# EAGLE design Bluesaab RN52 v5.5-DPAK (EAGLE 7.3.0)
All components except RN52 chip are back to top of PCB
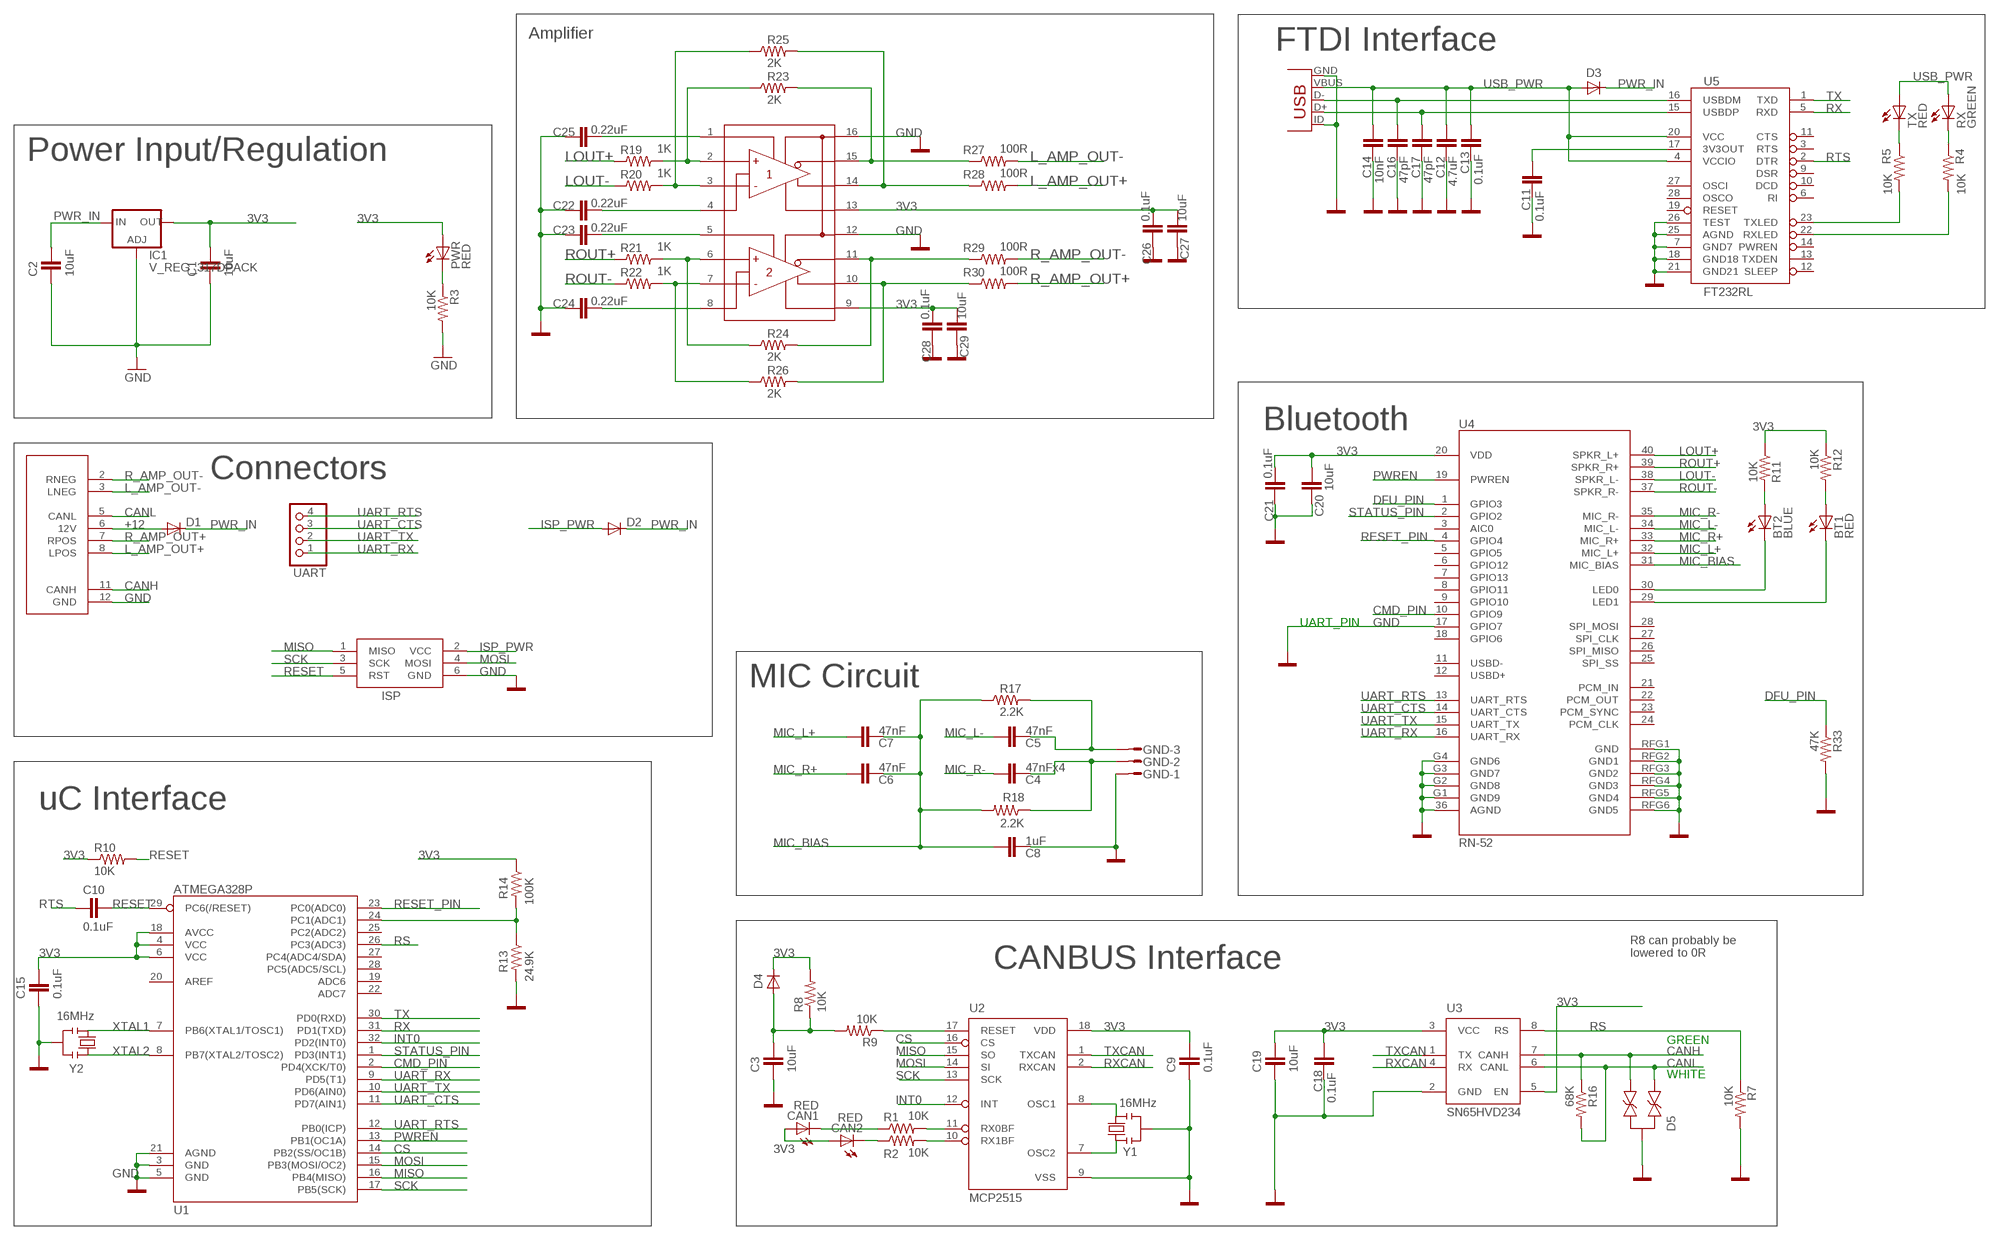
[diagram p0: schematic, sheet 1]

## Parts
BT1  RED  LEDCHIPLED_0805  [CHIPLED_0805]
BT2  BLUE  LEDCHIPLED_0805  [CHIPLED_0805]
C1  10uF  C-EUC0805K  [C0805K]
C2  10uF  C-EUC0805K  [C0805K]
C3  10uF  C-EUC0805K  [C0805K]
C4  47nFx4  C-EUC0805K  [C0805K]
C5  47nF  C-EUC0805K  [C0805K]
C6  47nF  C-EUC0805K  [C0805K]
C7  47nF  C-EUC0805K  [C0805K]
C8  1uF  C-EUC0805K  [C0805K]
C9  0.1uF  C-EUC0805K  [C0805K]
C10  0.1uF  C-EUC0805K  [C0805K]
C11  0.1uF  C-EUC0805K  [C0805K]
C12  4.7uF  C-EUC0805K  [C0805K]
C13  0.1uF  C-EUC0805K  [C0805K]
C14  10nF  C-EUC0805K  [C0805K]
C15  0.1uF  C-EUC0805K  [C0805K]
C16  47pF  C-EUC0805K  [C0805K]
C17  47pF  C-EUC0805K  [C0805K]
C18  0.1uF  C-EUC0805K  [C0805K]
C19  10uF  C-EUC0805K  [C0805K]
C20  10uF  C-EUC0805K  [C0805K]
C21  0.1uF  C-EUC0805K  [C0805K]
C22  0.22uF  C-EUC0805K  [C0805K]
C23  0.22uF  C-EUC0805K  [C0805K]
C24  0.22uF  C-EUC0805K  [C0805K]
C25  0.22uF  C-EUC0805K  [C0805K]
C26  0.1uF  C-EUC0805K  [C0805K]
C27  10uF  C-EUC0805K  [C0805K]
C28  0.1uF  C-EUC0805K  [C0805K]
C29  10uF  C-EUC0805K  [C0805K]
CAN1  RED  LEDCHIPLED_0805  [CHIPLED_0805]
CAN2  RED  LEDCHIPLED_0805  [CHIPLED_0805]
CDC_CONNECTOR  827229-1  [827229-1]
D1  DIODE-SCHOTTKY_  DIODE-SOD123  [SOD123]
D2  DIODE-SCHOTTKY_  DIODE-SOD123  [SOD123]
D3  DIODE-SCHOTTKY_  DIODE-SOD123  [SOD123]
D4  DIODE-SCHOTTKY_  DIODE-SOD123  [SOD123]
D5  DIODE-ARRAY  [SOT23]
GND  S03P  [S03P]
IC1  V_REG_317DPACK  [V-REG_DPACK]
ISP  AVRISP-6  [AVRISP]
PWR  RED  LEDCHIPLED_0805  [CHIPLED_0805]
R1  10K  R-US_R0805  [R0805]
R2  10K  R-US_R0805  [R0805]
R3  10K  R-US_R0805  [R0805]
R4  10K  R-US_R0805  [R0805]
R5  10K  R-US_R0805  [R0805]
R7  10K  R-US_R0805  [R0805]
R8  10K  R-US_R0805  [R0805]
R9  10K  R-US_R0805  [R0805]
R10  10K  R-US_R0805  [R0805]
R11  10K  R-US_R0805  [R0805]
R12  10K  R-US_R0805  [R0805]
R13  24.9K  R-US_R0805  [R0805]
R14  100K  R-US_R0805  [R0805]
R16  68K  R-US_R0805  [R0805]
R17  2.2K  R-US_R0805  [R0805]
R18  2.2K  R-US_R0805  [R0805]
R19  1K  R-US_R0805  [R0805]
R20  1K  R-US_R0805  [R0805]
R21  1K  R-US_R0805  [R0805]
R22  1K  R-US_R0805  [R0805]
R23  2K  R-US_R0805  [R0805]
R24  2K  R-US_R0805  [R0805]
R25  2K  R-US_R0805  [R0805]
R26  2K  R-US_R0805  [R0805]
R27  100R  R-US_R0805  [R0805]
R28  100R  R-US_R0805  [R0805]
R29  100R  R-US_R0805  [R0805]
R30  100R  R-US_R0805  [R0805]
R33  47K  R-US_R0805  [R0805]
RX  GREEN  LEDCHIPLED_0805  [CHIPLED_0805]
TX  RED  LEDCHIPLED_0805  [CHIPLED_0805]
U1  ATMEGA328P  ATMEGA328_SMT  [TQFP32-08]
U2  MCP2515  [SO18L]
U3  SN65HVD234  [SO8]
U4  RN-52  BLUETOOTH-RN-52  [RN-52]
U5  FT232RL  FT232RLSSOP  [SSOP28DB]
U7  THS4522  [TSSOP-16]
UART  PINHD-1X4  [1X04]
UPLOAD  USB-MB-H  [USB-MB-H]
Y1  16MHz  RESONATORSMD  [RESONATOR-SMD]
Y2  16MHz  RESONATORSMD  [RESONATOR-SMD]

## Nets
3V3: C1.2 C9.2 C15.2 C18.1 C19.2 C20.1 C21.2 C26.2 C27.1 C28.2 C29.1 CAN1.A CAN2.A D4.C IC1.4(OUT) PWR.A R8.2 R10.1 R11.1 R12.1 R14.1 U1.4(VCC) U1.6(VCC) U1.18(AVCC) U2.18(VDD) U3.3(VCC) U3.5(EN) U4.20(VDD) U7.9(9.VS+2) U7.13(13.VS+1)
3V3OUT: C11.1 U5.17(3V3OUT)
+12 [12v]: CDC_CONNECTOR.6(12V) D1.A
CANH: CDC_CONNECTOR.11(CANH) D5.2 R16.1 U3.7(CANH)
CANL: CDC_CONNECTOR.5(CANL) D5.1 R16.2 U3.6(CANL)
CMD_PIN: U1.2(PD4(XCK/T0)) U4.10(GPIO9)
CS: U1.14(PB2(SS/OC1B)) U2.16(CS)
DFU_PIN: R33.1 U4.1(GPIO3)
GND: C1.1 C2.1 C3.1 C8.1 C9.1 C11.2 C12.1 C13.2 C14.1 C15.1 C16.1 C17.1 C18.2 C19.1 C20.2 C21.1 C22.2 C23.2 C24.2 C25.2 C26.1 C27.2 C28.1 C29.2 CDC_CONNECTOR.12(GND) D5.3 GND.1 IC1.1(ADJ) ISP.6(GND) R3.2 R7.2 R13.2 R33.2 U1.3(GND) U1.5(GND) U1.21(AGND) U2.9(VSS) U3.2(GND) U4.17(GPIO7) U4.36(AGND) U4.G1(GND9) U4.G2(GND8) U4.G3(GND7) U4.G4(GND6) U4.RFG1(GND) U4.RFG2(GND1) U4.RFG3(GND2) U4.RFG4(GND3) U4.RFG5(GND4) U4.RFG6(GND5) U5.7(GND7) U5.18(GND18) U5.21(GND21) U5.25(AGND) U5.26(TEST) U7.12(12.VS-) U7.16(16.VS-) UPLOAD.GND UPLOAD.ID Y1.2 Y2.2
INT0: U1.32(PD2(INT0)) U2.12(INT)
ISP_PWR: D2.A ISP.2(VCC)
L_AMP_OUT+: CDC_CONNECTOR.8(LPOS) R28.2
L_AMP_OUT-: CDC_CONNECTOR.3(LNEG) R27.2
LOUT+: R19.1 U4.40(SPKR_L+)
LOUT-: R20.1 U4.38(SPKR_L-)
MIC_BIAS: C6.1 C7.1 C8.2 R17.1 R18.2 U4.31(MIC_BIAS)
MIC_L+: C7.2 U4.32(MIC_L+)
MIC_L-: C5.1 U4.34(MIC_L-)
MIC_R+: C6.2 U4.33(MIC_R+)
MIC_R-: C4.1 U4.35(MIC_R-)
MISO: ISP.1(MISO) U1.16(PB4(MISO)) U2.15(SO)
MOSI: ISP.4(MOSI) U1.15(PB3(MOSI/OC2)) U2.14(SI)
N$1: R4.2 U5.22(RXLED)
N$2: R19.2 R23.1 U7.2(2.VIN1+)
N$4: U2.8(OSC1) Y1.3
N$5: U2.7(OSC2) Y1.1
N$6: BT1.A R12.2
N$7: BT2.A R11.2
N$8: R9.1 U2.17(RESET)
N$9: R13.1 R14.2 U1.24(PC1(ADC1))
N$10: R5.2 U5.23(TXLED)
N$11: R20.2 R25.1 U7.3(3.VIN1-)
N$12: R4.1 RX.C
N$13: CAN1.C R1.1
N$14: R21.2 R24.1 U7.6(6.IN2+)
N$15: R5.1 TX.C
N$16: CAN2.C R2.1
N$17: PWR.C R3.1
N$18: R1.2 U2.11(RX0BF)
N$19: R22.2 R26.1 U7.7(7.IN2-)
N$20: C25.1 U7.1(1.PD1)
N$21: C23.1 U7.5(5.PD2)
N$22: C22.1 U7.4(4.OCM1)
N$23: C4.2 GND.2 R18.1
N$24: R23.2 R27.1 U7.15(15.VOUT1-)
N$25: C5.2 GND.3 R17.2
N$26: R25.2 R28.1 U7.14(14.VOUT1+)
N$27: C24.1 U7.8(8.VOCM2)
N$28: BT1.C U4.29(LED1)
N$29: BT2.C U4.30(LED0)
N$31: R2.2 U2.10(RX1BF)
N$32: R24.2 R29.1 U7.11(11.VOUT2-)
N$33: R26.2 R30.1 U7.10(10.VOUT2+)
N$35: C3.2 D4.A R8.1 R9.2
PWR_IN [12v]: C2.2 D1.C D2.C D3.C IC1.3(IN)
PWREN: U1.13(PB1(OC1A)) U4.19(PWREN)
R_AMP_OUT+: CDC_CONNECTOR.7(RPOS) R30.2
R_AMP_OUT-: CDC_CONNECTOR.2(RNEG) R29.2
RESET: C10.2 ISP.5(RST) R10.2 U1.29(PC6(/RESET))
RESET_PIN: U1.23(PC0(ADC0)) U4.4(GPIO4)
ROUT+: R21.1 U4.39(SPKR_R+)
ROUT-: R22.1 U4.37(SPKR_R-)
RS: R7.1 U1.26(PC3(ADC3)) U3.8(RS)
RTS: C10.1 U5.2(DTR)
RX: U1.31(PD1(TXD)) U5.5(RXD)
RXCAN: U2.2(RXCAN) U3.4(RX)
SCK: ISP.3(SCK) U1.17(PB5(SCK)) U2.13(SCK)
STATUS_PIN: U1.1(PD3(INT1)) U4.2(GPIO2)
TX: U1.30(PD0(RXD)) U5.1(TXD)
TXCAN: U2.1(TXCAN) U3.1(TX)
UART_CTS: U1.11(PD7(AIN1)) U4.14(UART_CTS) UART.3
UART_RTS: U1.12(PB0(ICP)) U4.13(UART_RTS) UART.4
UART_RX: U1.9(PD5(T1)) U4.16(UART_RX) UART.1
UART_TX: U1.10(PD6(AIN0)) U4.15(UART_TX) UART.2
USB_PWR: C12.2 C13.1 C14.2 D3.A RX.A TX.A U5.4(VCCIO) U5.20(VCC) UPLOAD.VBUS
USBDM: C16.2 U5.16(USBDM) UPLOAD.D-
USBDP: C17.2 U5.15(USBDP) UPLOAD.D+
XTAL1: U1.7(PB6(XTAL1/TOSC1)) Y2.1
XTAL2: U1.8(PB7(XTAL2/TOSC2)) Y2.3
Unconnected: U1.19(ADC6) U1.20(AREF) U1.22(ADC7) U1.25(PC2(ADC2)) U1.27(PC4(ADC4/SDA)) U1.28(PC5(ADC5/SCL)) U4.3(AIC0) U4.5(GPIO5) U4.6(GPIO12) U4.7(GPIO13) U4.8(GPIO11) U4.9(GPIO10) U4.11(USBD-) U4.12(USBD+) U4.18(GPIO6) U4.21(PCM_IN) U4.22(PCM_OUT) U4.23(PCM_SYNC) U4.24(PCM_CLK) U4.25(SPI_SS) U4.26(SPI_MISO) U4.27(SPI_CLK) U4.28(SPI_MOSI) U5.3(RTS) U5.6(RI) U5.9(DSR) U5.10(DCD) U5.11(CTS) U5.12(SLEEP) U5.13(TXDEN) U5.14(PWREN) U5.19(RESET) U5.27(OSCI) U5.28(OSCO)

## Notes on the sheet
- Amplifier
- FTDI Interface
- Power Input/Regulation
- Bluetooth
- Connectors
- UART_PIN
- MIC Circuit
- uC Interface
- R8 can probably be
  lowered to 0R
- CANBUS Interface
- GREEN
- WHITE

## Library data of the parts
BT1 BT2 CAN1 CAN2 PWR RX TX = led:LED: LED OSRAM: - CHIPLED LG R971, LG N971, LY N971, LG Q971, LY Q971, LO R971, LY R971 LH N974, LH R974 LS Q976, LO Q976, LY Q976 LO Q996 - Hyper CHIPLED LW Q18S LB Q993, LB Q99A, LB R99A - SideLED LS A670, LO A670, LY A670, LG A670, LP A670 LB A673, LV A673, LT A673, LW A673 LH A674 LY A675 LS A676, LA A676, LO A676, LY A676, LW A676 LS A679, LY A679, LG A679 - Hyper Micro SIDELED® LS Y876, LA Y876, LO Y876, LY Y876 LT Y87S - SmartLED LW L88C, LW L88S LB L89C, LB L89S, LG L890 LS L89K, LO L89K, LY L89K LS L896, LA L896, LO L896, LY L896 - TOPLED LS T670, LO T670, LY T670, LG T670, LP T670 LSG T670, LSP T670, LSY T670, LOP T670, LYG T670 LG T671, LOG T671, LSG T671 LB T673, LV T673, LT T673, LW T673 LH T674 LS T676, LA T676, LO T676, LY T676, LB T676, LH T676, LSB T676, LW T676 LB T67C, LV T67C, LT T67C, LS T67K, LO T67K, LY T67K, LW E67C LS E67B, LA E67B, LO E67B, LY E67B, LB E67C, LV E67C, LT E67C LW T67C LS T679, LY T679, LG T679 LS T770, LO T770, LY T770, LG T770, LP T770 LB T773, LV T773, LT T773, LW T773 LH T774 LS E675, LA E675, LY E675, LS T675 LS T776, LA T776, LO T776, LY T776, LB T776 LHGB T686 LT T68C, LB T68C - Hyper Mini TOPLED® LB M676 - Mini TOPLED Santana® LG M470 LS M47K, LO M47K, LY M47K Source: http://www.osram.convergy.de LUXEON: - LUMILED® LXK2-PW12-R00, LXK2-PW12-S00, LXK2-PW14-U00, LXK2-PW14-V00 LXK2-PM12-R00, LXK2-PM12-S00, LXK2-PM14-U00 LXK2-PE12-Q00, LXK2-PE12-R00, LXK2-PE12-S00, LXK2-PE14-T00, LXK2-PE14-U00 LXK2-PB12-K00, LXK2-PB12-L00, LXK2-PB12-M00, LXK2-PB14-N00, LXK2-PB14-P00, LXK2-PB14-Q00 LXK2-PR12-L00, LXK2-PR12-M00, LXK2-PR14-Q00, LXK2-PR14-R00 LXK2-PD12-Q00, LXK2-PD12-R00, LXK2-PD12-S00 LXK2-PH12-R00, LXK2-PH12-S00 LXK2-PL12-P00, LXK2-PL12-Q00, LXK2-PL12-R00 Source: www.luxeon.com KINGBRIGHT: KA-3528ASYC Source: www.kingbright.com
C1-C29 = rcl:C-EU: CAPACITOR, European symbol
CDC_CONNECTOR = 827229-1:827229-1
D1-D4 = diode_seth:DIODE-: DIODE
D5 = SparkFun-seth:DIODE-ARRAY: NUP2105L, TVS Diode Array
GND = con-amp-mt:S03P: AMP MT CONNECTOR; OC_FARNELL: unknown; OC_NEWARK: unknown
IC1 = SparkFun-PowerIC:V_REG_317: Voltage Regulator Standard LM317 adjustable voltage regulator. AOI (Adjust Output Input). Google 'LM317 Calculator' for easy to use app to get the two resistor values needed. 240/720 for 5V output. 240/390 for 3.3V output. Spark Fun Electronics SKU : COM-00527; PROD_ID: IC-09888
ISP = adafruit:AVRISP: AVR ISP HEADER Standard 6 pin header for AVR programming
R1-R5 R7-R14 R16-R30 R33 = rcl:R-US_: RESISTOR, American symbol
U1 = SparkFun-DigitalIC:ATMEGA328_SMT: 32-Pin Atmega328 part Commonly used on Arduino compatible boards Available in QFP and QFN packages TQFP is IC-09069 QFN is non-stock; PROD_ID: IC-09069
U2 = mcp2515-seth:MCP2515
U3 = ti-can-seth:SN65HVD234
U4 = SparkFun-RF:BLUETOOTH-RN-52
U5 = SparkFun-DigitalIC:FT232RL: USB UART FT232RL 4th Generation USB UART (USB <-> Serial) Controller. Spark Fun Electronics SKU : COM-00650 Production SKU IC-00870; PROD_ID: IC-00870
U7 = ti-differential-amps:THS4522
UART = pinhead:PINHD-1X4: PIN HEADER
UPLOAD = USB Mini_B VERT:USB: USB Connectors USB-MB-H has not been used/tested
Y1 Y2 = SparkFun-seth:RESONATOR: Resonator Small SMD resonator. This is the itty bitty 10/20MHz resonators with built in caps. CSTCE10M0G55 and CSTCE20M0V53. Footprint has been reviewed closely but hasn't been tested yet.

## Net classes
0 default: width 0.254 mm, clearance 0.205 mm
1 12v: width 0.5 mm, clearance 0.205 mm to class 0, clearance 0.205 mm

## Board
Moved U4 (RN52) to south-east to make space to integrated THS4522 amp circuit Moved UART connector, moved audio jack socket Removed Killswitch, 555 circuit, RN52_Firmware update, external amp pins
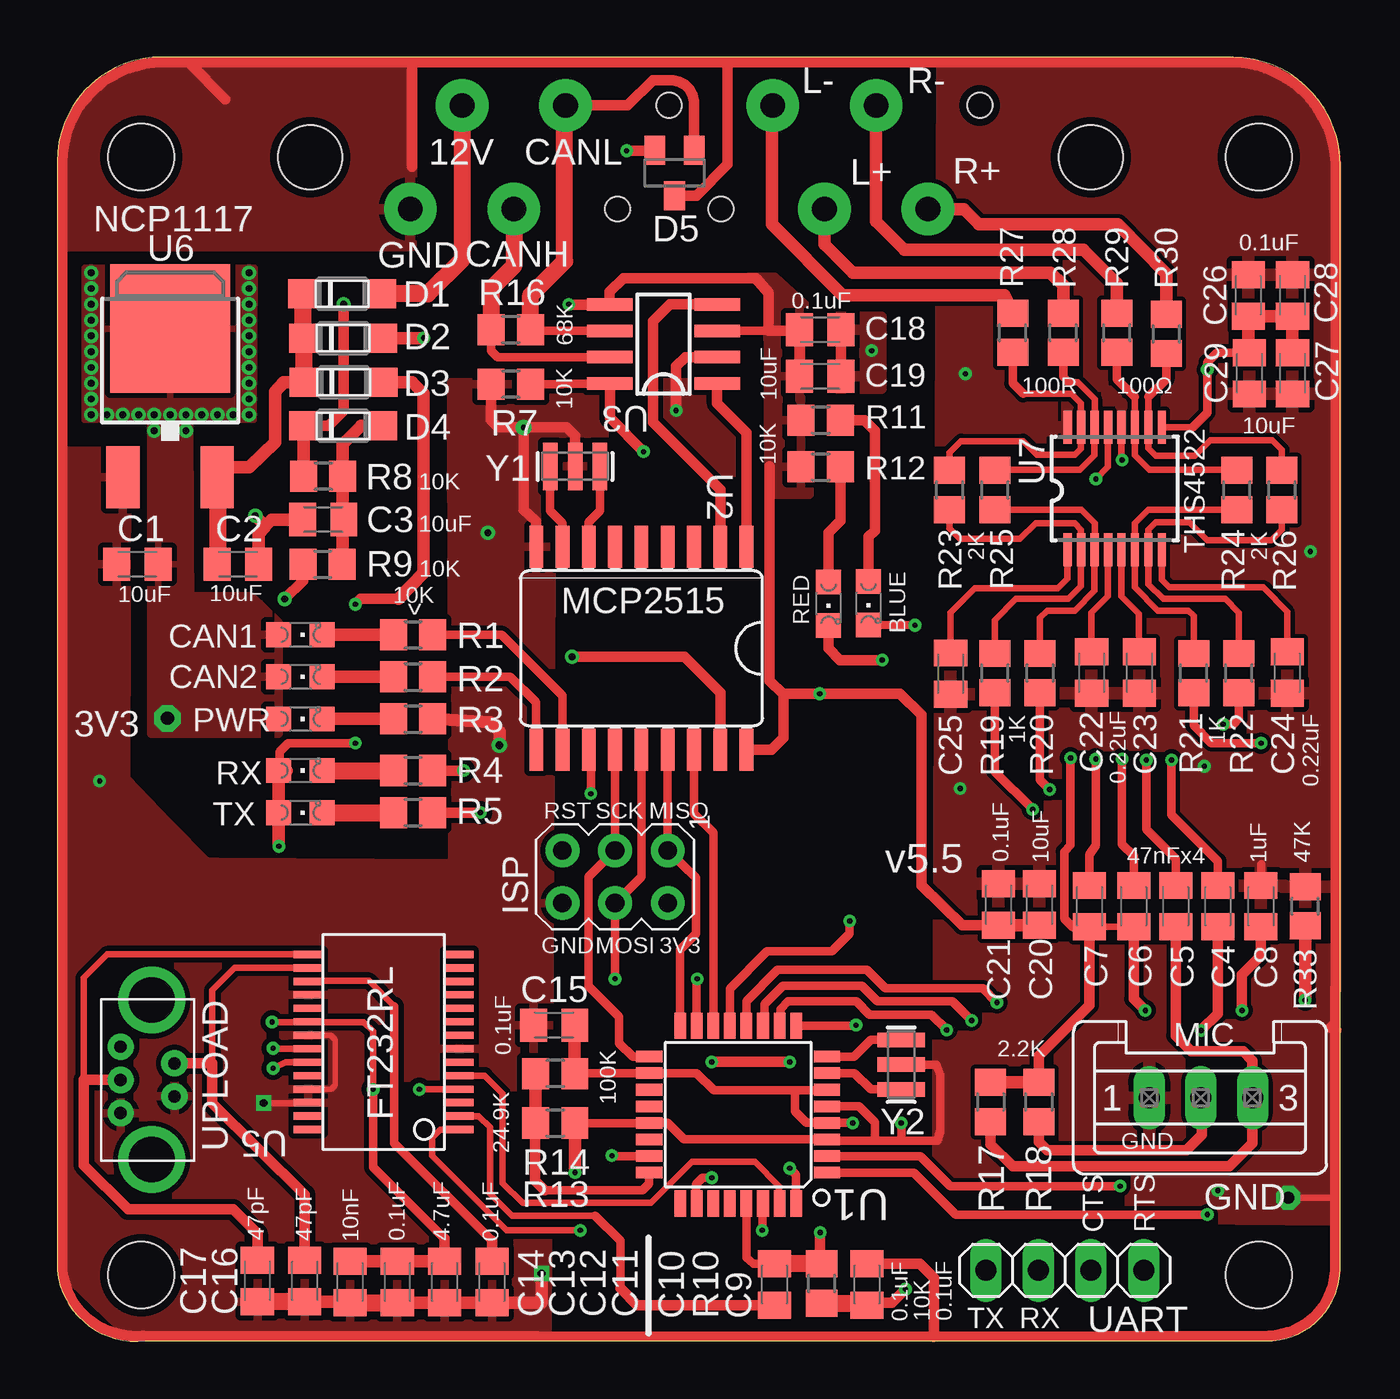
[diagram p1: board, top side]
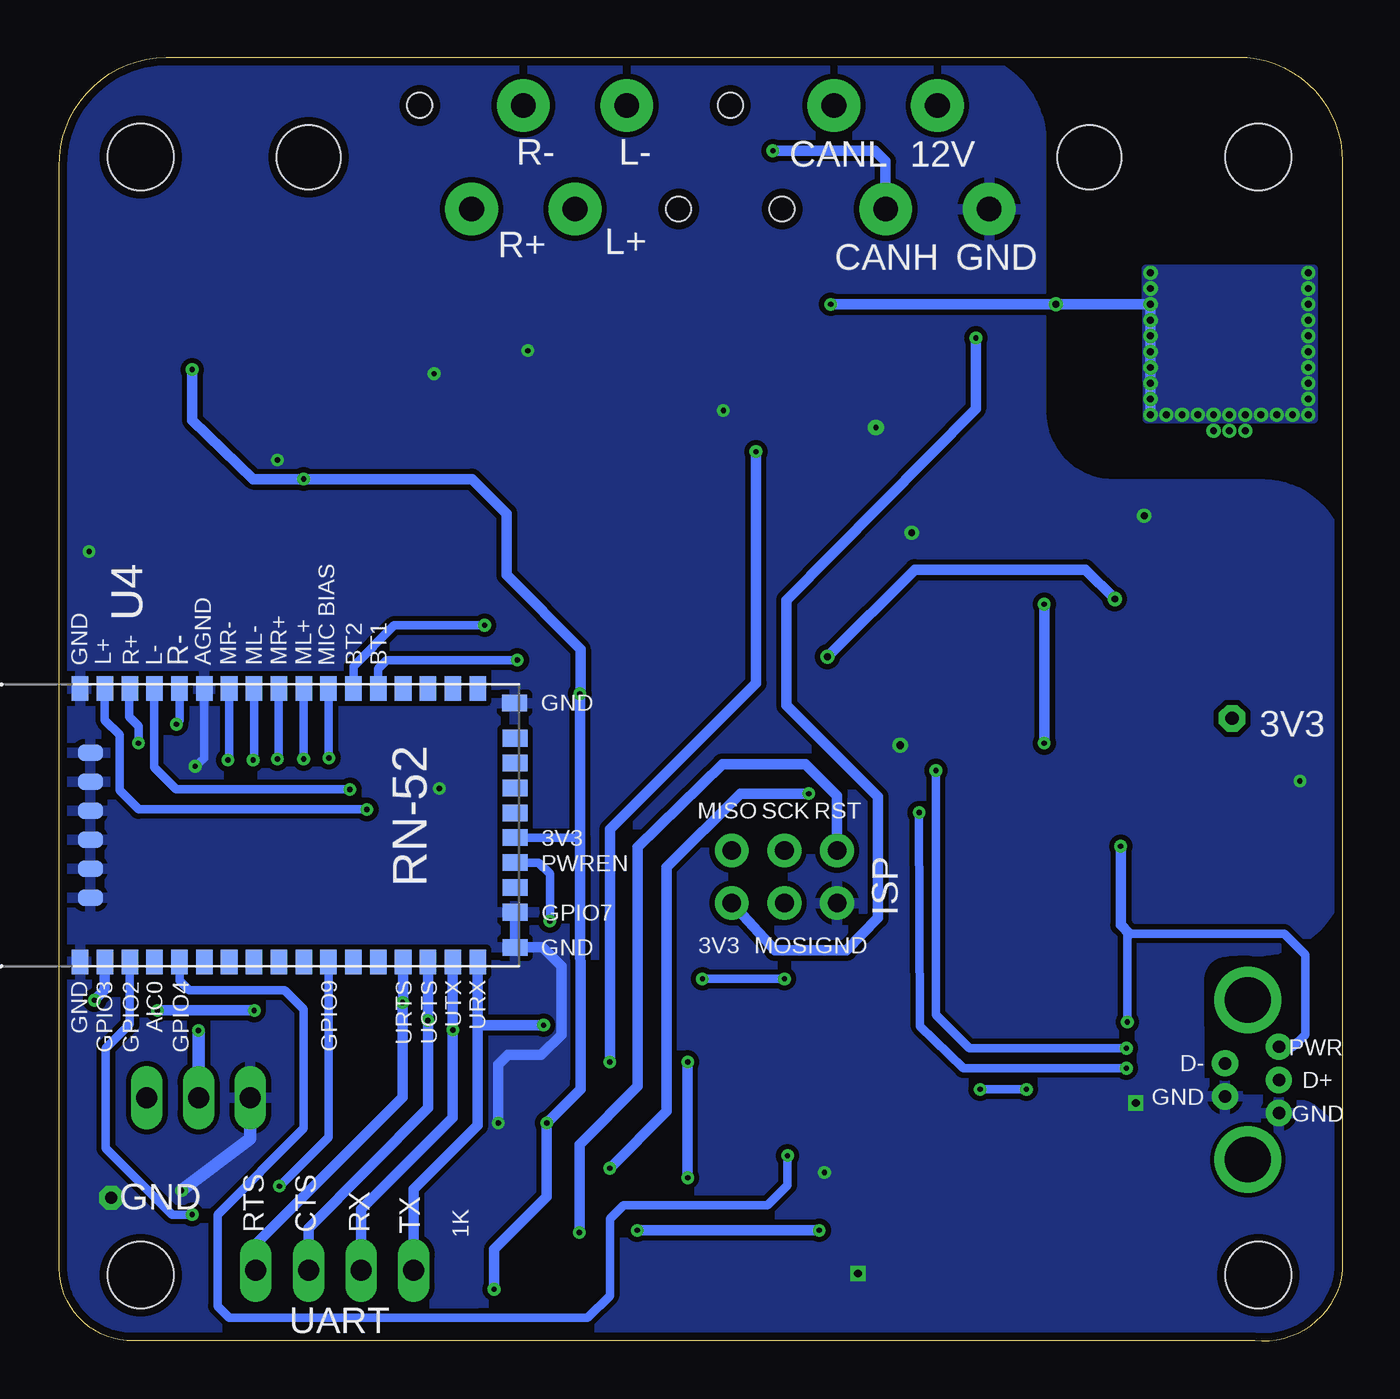
[diagram p2: board, bottom side, seen from below]

Size 61.98 x 62 mm. Coordinates in mm from the lower left corner, seen from the top.
Outline: 56.81,62 5.06,62 arc90 0,56.97 0,3.42 arc90 4.24,0.02 58.4,0.02 arc90 61.98,3.53 61.98,56.71 arc90 56.81,62
Copper layers (1*16): Top 0.0356mm / dielectric 1.5011mm / Bottom 0.0356mm
Design rules "Bluesaab RN52 v5.5-DPAK": minimum track width 8mil, minimum drill 13mil, track to track 0.205mm, track to pad 0.205mm, pad to pad 0.205mm, via to via 0.205mm, smd to smd 6mil, copper to edge 15mil, drill to drill 6mil, minimum pad ring 7mil, minimum via ring 7mil, stop-mask expansion 4mil, vias tented up to drill 15mil, thermal gap 10mil
Holes 3.2 mm at 4.06,57.17 58.04,57.17 58.04,3.2 4.06,3.2

### Footprints (pad centres in the part's own frame; a part is rotated, then mirrored left to right if it is on the bottom)
CHIPLED_0805 = smd 1.2 x 1.2: A 0,-1.05; C 0,1.05
C0805K = smd 1.3 x 1.6: 1 -1,0; 2 1,0
827229-1 = drill 1.2 pad 2.54: 2 2.96,-9.495; 3 2.96,-4.495; 5 2.96,5.505; 6 2.96,10.505; 7 -2.04,-11.995; 8 -2.04,-6.995; 11 -2.04,8.005; 12 -2.04,13.005 | hole 3.1: 0.46,17.84; 0.46,-19.86 | hole 1.2: -2.04,3.005; 2.96,-14.495; -2.04,-1.995; 2.96,0.505
SOD123 = smd 1.4 x 1.4: A 1.9,0; C -1.9,0
SOT23 = smd 1 x 1.4: 1 -0.95,-1.1; 2 0.95,-1.1; 3 0,1.1
S03P = drill 1.016 long: 1 2.5,0; 2 0,0; 3 -2.5,0
V-REG_DPACK = smd 1.6 x 3: 1 -2.28,-4.8; 3 2.28,-4.8 | smd 5.8 x 6.2: 4 0,2.38
AVRISP = drill 0.9 pad 1.626: 1 -1.27,2.54; 2 1.27,2.54; 3 -1.27,0; 4 1.27,0; 5 -1.27,-2.54; 6 1.27,-2.54
R0805 = smd 1.3 x 1.5: 1 -0.95,0; 2 0.95,0
TQFP32-08 = smd 1.27 x 0.559: 1 -4.293,2.8; 2 -4.293,2; 3 -4.293,1.2; 4 -4.293,0.4; 5 -4.293,-0.4; 6 -4.293,-1.2; 7 -4.293,-2; 8 -4.293,-2.8; 17 4.293,-2.8; 18 4.293,-2; 19 4.293,-1.2; 20 4.293,-0.4; 21 4.293,0.4; 22 4.293,1.2; 23 4.293,2; 24 4.293,2.8 | smd 0.559 x 1.27: 9 -2.8,-4.293; 10 -2,-4.293; 11 -1.2,-4.293; 12 -0.4,-4.293; 13 0.4,-4.293; 14 1.2,-4.293; 15 2,-4.293; 16 2.8,-4.293; 25 2.8,4.293; 26 2,4.293; 27 1.2,4.293; 28 0.4,4.293; 29 -0.4,4.293; 30 -1.2,4.293; 31 -2,4.293; 32 -2.8,4.293
SO18L = smd 0.66 x 2.032: 1 -5.08,-4.902; 2 -3.81,-4.902; 3 -2.54,-4.902; 4 -1.27,-4.902; 5 0,-4.902; 6 1.27,-4.902; 7 2.54,-4.902; 8 3.81,-4.902; 9 5.08,-4.902; 10 5.08,4.902; 11 3.81,4.902; 12 2.54,4.902; 13 1.27,4.902; 14 0,4.902; 15 -1.27,4.902; 16 -2.54,4.902; 17 -3.81,4.902; 18 -5.08,4.902
SO8 = smd 0.6 x 2.2: 1 -1.905,-2.6; 2 -0.635,-2.6; 3 0.635,-2.6; 4 1.905,-2.6; 5 1.905,2.6; 6 0.635,2.6; 7 -0.635,2.6; 8 -1.905,2.6
RN-52 = smd 1.2 x 0.8: 1 -6.6,8.33; 2 -6.6,7.13; 3 -6.6,5.93; 4 -6.6,4.73; 5 -6.6,3.53; 6 -6.6,2.33; 7 -6.6,1.13; 8 -6.6,-0.07; 9 -6.6,-1.27; 10 -6.6,-2.47; 11 -6.6,-3.67; 12 -6.6,-4.87; 13 -6.6,-6.07; 14 -6.6,-7.27; 15 -6.6,-8.47; 16 -6.6,-9.67; 25 6.6,-9.67; 26 6.6,-8.47; 27 6.6,-7.27; 28 6.6,-6.07; 29 6.6,-4.87; 30 6.6,-3.67; 31 6.6,-2.47; 32 6.6,-1.27; 33 6.6,-0.07; 34 6.6,1.13; 35 6.6,2.33; 36 6.6,3.53; 37 6.6,4.73; 38 6.6,5.93; 39 6.6,7.13; 40 6.6,8.33; G1 -6.6,9.53; G4 6.6,9.53 | smd 0.8 x 1.2: 17 -4.2,-11.47; 18 -3,-11.47; 19 -1.8,-11.47; 20 -0.6,-11.47; 21 0.6,-11.47; 22 1.8,-11.47; 23 3,-11.47; 24 4.2,-11.47; G2 -5.9,-11.47; G3 5.9,-11.46; RFG1 -3.5,9.03; RFG2 -2.1,9.03; RFG3 -0.7,9.03; RFG4 0.7,9.03; RFG5 2.1,9.03; RFG6 3.5,9.03
SSOP28DB = smd 0.348 x 1.397: 1 -4.225,-3.656; 2 -3.575,-3.656; 3 -2.925,-3.656; 4 -2.275,-3.656; 5 -1.625,-3.656; 6 -0.975,-3.656; 7 -0.325,-3.656; 8 0.325,-3.656; 9 0.975,-3.656; 10 1.625,-3.656; 11 2.275,-3.656; 12 2.925,-3.656; 13 3.575,-3.656; 14 4.225,-3.656; 15 4.225,3.656; 16 3.575,3.656; 17 2.925,3.656; 18 2.275,3.656; 19 1.625,3.656; 20 0.975,3.656; 21 0.325,3.656; 22 -0.325,3.656; 23 -0.975,3.656; 24 -1.625,3.656; 25 -2.275,3.656; 26 -2.925,3.656; 27 -3.575,3.656; 28 -4.225,3.656
TSSOP-16 = smd 0.4 x 1.6: 1 -2.225,-2.85; 2 -1.575,-2.85; 3 -0.925,-2.85; 4 -0.275,-2.85; 5 0.375,-2.85; 6 1.025,-2.85; 7 1.675,-2.85; 8 2.325,-2.85; 9 2.325,3.05; 10 1.675,3.05; 11 1.025,3.05; 12 0.375,3.05; 13 -0.275,3.05; 14 -0.925,3.05; 15 -1.575,3.05; 16 -2.225,3.05
1X04 = drill 1.016 long: 1 -3.81,0; 2 -1.27,0; 3 1.27,0; 4 3.81,0
USB-MB-H = drill 0.6 pad 1.27: D+ 0,0; D- -2.6,0.8; GND 0,-1.6; ID -2.6,-0.8; VBUS 0,1.6 | drill 2.2: P$6 -1.5,-3.85; P$7 -1.5,3.85
RESONATOR-SMD = smd 0.7 x 2.286: 1 -1.2,0; 2 0,0; 3 1.2,0

### Placement (x,y rotation side)
BT1  37.26,35.61 180 top
BT2  39.19,35.63 180 top
C1  3.89,37.51 0 top
C2  8.74,37.51 180 top
C3  12.85,39.67 0 top
C4  56.06,21 270 top
C5  54.03,21 270 top
C6  51.99,21 90 top
C7  49.86,21 90 top
C8  58.14,21 270 top
C9  39.12,2.74 270 top
C10  34.65,2.74 90 top
C11  21.01,2.87 270 top
C12  18.72,2.87 90 top
C13  16.43,2.87 270 top
C14  14.15,2.87 90 top
C15  24,15.26 0 top
C16  11.96,2.92 90 top
C17  9.68,2.92 90 top
C18  36.86,48.84 0 top
C19  36.86,46.58 180 top
C20  47.45,21.08 90 top
C21  45.47,21.08 270 top
C22  49.96,32.28 270 top
C23  52.27,32.28 270 top
C24  59.41,32.28 270 top
C25  43.15,32.23 270 top
C26  57.53,50.49 270 top
C27  59.66,46.73 270 top
C28  59.66,50.49 270 top
C29  57.58,46.73 270 top
CAN1  11.76,34.11 270 top
CAN2  11.76,32.08 270 top
CDC_CONNECTOR  30.07,56.7 90 top
D1  13.77,50.57 0 top
D2  13.82,48.43 0 top
D3  13.84,46.3 0 top
D4  13.82,44.19 0 top
D5  29.82,56.41 180 top
DRILEGEND  [DRILEGEND]  -0.58,-4.24 0 top  (outside the outline)
GND  55.24,11.76 180 top
IC1  5.46,46.5 0 top
ISP  26.95,22.43 270 top
PWR  11.76,30.05 270 top
R1  17.2,34.11 0 top
R2  17.2,32.08 0 top
R3  17.2,30.05 0 top
R4  17.2,27.56 0 top
R5  17.2,25.52 0 top
R7  21.92,46.2 180 top
R8  12.85,41.76 180 top
R9  12.83,37.51 0 top
R10  36.93,2.79 90 top
R11  36.88,44.47 0 top
R12  36.88,42.21 0 top
R13  24.05,10.54 0 top
R14  24.05,12.93 180 top
R16  21.92,48.84 0 top
R17  45.09,11.55 270 top
R18  47.42,11.55 90 top
R19  45.29,32.25 90 top
R20  47.47,32.25 90 top
R21  54.89,32.25 90 top
R22  57.07,32.25 90 top
R23  43.1,41.09 90 top
R24  56.97,41.09 90 top
R25  45.29,41.09 90 top
R26  59.16,41.09 90 top
R27  46.15,48.69 90 top
R28  48.59,48.69 90 top
R29  51.18,48.69 90 top
R30  53.57,48.64 90 top
R33  60.27,21 90 top
RX  11.76,27.56 270 top
TX  11.76,25.52 270 top
U1  32.89,10.94 180 top
U2  28.22,33.45 180 top
U3  29.29,48.14 90 top
U4  51.43,24.91 90 bottom
U5  15.77,14.45 90 top
U7  51.03,41.07 0 top
UART  48.67,3.43 0 top
UPLOAD  3.07,12.62 0 bottom
Y1  25.02,42.24 180 top
Y2  40.77,13.36 90 top

### Tracks (layer width: path | path; a pad name or v marks a point on that pad's centre or on a via)
3V3  (via drill 0.25, 0.33, 0.64 pad 1.27)
  Top 0.305: 37.15,12.11 U1.6 | 35.64,12.01 35.53,12.11 | v38.42,10.54 v38.43,10.54 | 39.07,1.85 C9.2 | U7.13 50.75,42.22 v50.16,41.63 | U7.9 54.84,44.12
  Top 0.406: U3.3 35.83,48.78 | 37.15,12.11 35.53,12.11 31.73,12.11 30.89,12.94 U1.18 25.02,12.94 R14.1 | 35.64,12.01 35.64,11.1 36.19,10.54 U1.4 v38.42,10.54 | C29.1 56.02,47.73 55.55,47.27 v55.55,46.91 55.55,44.83 54.84,44.12
  Top 0.5: U2.18 | U1.18
  Top 0.508: v24.71,50.06 24.73,50.05 U3.5 26.69,50.67 27.36,51.33 33.76,51.33 34.37,50.62 34.37,48.79 35.83,48.78 | 35.89,47.5 C18.1 C19.2 | D4.C 13.11,44.19 13.84,44.93 v13.84,50.06 | C21.2 43.72,20.08 41.73,22.02 41.73,30.25 40.72,31.26 v36.83,31.26 35.05,31.26 | 39.07,1.85 40.31,1.85 v40.97,2.51 | 35.05,31.26 34.42,31.9 34.41,39.4 34.41,42.23 34.42,42.24 | U2.18 34.49,28.55 35.08,29.13 35.08,31.24 35.05,31.26
  Top 0.61: D4.C 11.92,41.78 R8.2 | 39.06,1.84 C9.2 | C20.1 C21.2 | C27.1 C28.2 C26.2 57.53,47.78 C29.1 | C15.2 R14.1
  Top 0.813: R10.1 39.06,1.84 | 35.93,41.89 R12.1
  Bottom 0.305: 36.8,31.29 v36.83,31.26
  Bottom 0.406: U4.20 36.81,24.31
  Bottom 0.508: v24.71,50.06 v13.84,50.06 v9.27,50.06 v9.27,44.73 | v36.83,31.26 36.81,24.31 36.8,12.52 36.79,12.17 v38.43,10.54 38.43,6.98 40.97,4.44 v40.97,2.51 | 36.8,31.29 36.8,33.4 40.36,37 40.36,39.95 42.04,41.63 v50.16,41.63 52.6,41.63 55.55,44.47 v55.55,46.91
  other vias: 1.65,51.58 1.65,50.82 1.65,50.06 1.65,49.3 1.65,47.77 1.65,47.01 1.65,46.25 1.65,45.49 6.22,44.73 6.99,44.73 7.75,44.73 9.27,46.25 9.27,45.49 8.51,44.73 9.27,49.3 9.27,48.54 9.27,47.77 9.27,47.01 4.7,44.73 5.46,44.73 4.7,43.96 5.46,43.96 3.17,44.73 3.94,44.73 2.41,44.73 1.65,44.73 6.22,43.96 5.33,30.07 9.27,50.82 9.27,51.58 1.65,48.54
  pour Bottom: 1.4,51.79 1.4,44.52 9.45,44.52 9.5,51.79
  pour Top: 1.35,51.84 9.55,51.84 9.5,44.47 6.43,44.52 6.48,34.62 4.5,34.67 4.5,44.57 1.35,44.47
  pour Top: 4.55,29.33 10.69,29.33 10.69,34.69 9.37,35.96 4.55,35.96
  pour Top: 34.37,40.87 36.35,40.87 36.3,49.91 34.67,51.38 33.4,51.38 33.81,51.33 34.32,50.77
3V3OUT
  Top 0.305: 16.28,16.18 15.06,17.4 12.14,17.4 U5.17
  Top 0.406: 16.28,16.18 16.28,9.57 21.01,4.85
  Top 0.508: 21.01,4.85 C11.1
+12
  Top 0.813: CDC_CONNECTOR.6 19.56,52.22 17.91,50.57 D1.A
CANH  (via drill 0.25)
  Top 0.406: U3.7 21.27,47.51 20.96,47.83 20.96,48.83 R16.1
  Top 0.508: v27.51,57.48 28.84,57.48 D5.2
  Top 0.813: CDC_CONNECTOR.11 22.06,51.93 20.96,50.82 20.96,48.86 R16.1
  Bottom 0.508: CDC_CONNECTOR.11 22.06,56.96 22.58,57.48 v27.51,57.48
CANL
  Top 0.406: U3.6 22.93,48.78 R16.2 | 30.76,57.52 D5.1 | 30.76,59.76 30.76,59.66
  Top 0.508: 30.76,59.66 30.76,57.52 | 30.76,59.76 arc90 29.64,60.88 29.19,60.88 28.78,60.88 27.56,59.66 CDC_CONNECTOR.5
  Top 0.813: R16.2 22.87,50.5 24.51,52.14 24.51,59.61 CDC_CONNECTOR.5
CMD_PIN  (via drill 0.25)
  Top 0.406: U1.2 41.7,8.94 43.15,7.49 v51.33,7.49
  Bottom 0.406: U4.10 48.96,9.86 v51.33,7.49
CS
  Top 0.406: U2.16 30.76,25.47 31.69,24.54 U1.14
DFU_PIN  (via drill 0.25)
  Top 0.61: v60.27,16.47 R33.1
  Bottom 0.508: U4.1 59.77,16.98 v60.27,16.47
GND  (via drill 0.25, 0.25 pad 0.76, 0.33, 0.38, 0.6 pad 1.14)
  Top 0.254: U5.21 13.21,14.77 13.44,14.55 13.44,12.37 13.23,12.16 12.13,12.16 U5.25
  Top 0.305: v59.46,6.93 61.72,6.93 | U7.12 51.4,42.57 v51.43,42.54 | v9.98,11.5 12.1,11.5 U5.26
  Top 0.406: U1.21 29.48,10.54 30.28,9.74 U1.3 37.26,9.67 39.37,9.67 | 58.15,23.03 C8.1 | Y2.2 42.47,13.36 42.67,12.85 42.67,10.18 42.52,9.67 40.77,9.67 | 40.77,9.67 39.37,9.67 | U1.5 38.72,11.34 39.5,10.56 39.5,9.8 39.37,9.67 | v40.77,10.54 40.77,9.67 | 28.58,10.54 25.17,10.54
  Top 0.5: 0.25,10.15 0.25,9.93
  Top 0.508: 42.34,0.23 4.17,0.28 arc-90 0.25,3.43 0.25,9.93 0.25,56.92 arc-90 5.11,61.74 6.35,61.74 | 42.34,0.23 58.55,0.28 arc90 61.72,3.68 61.72,6.93 61.72,15.01 61.72,17.07 | 6.35,61.74 17.14,61.74 | 17.14,61.74 17.14,56.69 | 17.14,61.74 32.38,61.74 | 32.38,61.74 56.52,61.74 arc-90 61.75,56.87 61.75,16.94 | v22.53,44.12 22.53,40.15 23.14,39.6 U2.9 | 6.35,61.74 8.13,59.97 | Y1.2 25.02,43.71 24.61,44.12 v22.53,44.12 | U3.2 30.34,47.51 29.9,47.06 v29.9,44.93 | v22.53,44.12 21.31,44.12 20.96,44.47 20.96,45.73 R7.2 | C18.2 C19.1 | C9.1 41.67,3.74 42.34,3.07 42.34,0.23 | D5.3 30.88,55.31 32.38,56.82 32.38,61.74 | 25.17,10.54 R13.2
  Top 0.61: 61.57,15.16 61.72,15.01 | C3.1 10.36,39.67 9.73,39.04 9.73,37.52 C2.1 9.74,39 10.03,39.29 10.03,39.39 v9.58,39.85 | R3.2 20.9,29.89 21.36,29.44 v21.36,28.78 | v25.02,8.15 25.02,10.52 R13.2 | C16.1 14.15,1.92 C14.1 | C13.2 C12.1 C11.2 23.39,1.87 v23.39,3.27
  Top 0.813: C14.1 C13.2 | C16.1 C17.1
  Bottom 0.406: U4.36 54.96,28.15 v55.4,27.76
  Bottom 0.508: U4.17 U4.G2 38.63,19.01 37.72,18.11 37.72,14.81 38.69,13.83 40.29,13.83 Y2.2 v40.77,10.54
  Bottom 0.61: v56.06,7.29 52.76,9.78 52.76,11.75 GND.1
  other vias: 20.8,39.04 2.06,27.05 60.53,38.12 43.87,46.71 43.61,26.69 39.34,47.83
  pour Top: 17.14,52.85 17.14,61.74 5.46,61.74 arc90 0.25,56.92 0.25,52.85
  pour Top: 0.2,43 3.38,43 3.35,27.15 5.33,25.07 7.29,23.09 0.2,23.03
  pour Top: 61.7,5.86 61.7,61.74 42.75,61.9 42.54,6.07
  pour Top (isolate 0.254): 0.28,23.19 19.08,23.09 19.02,46.3 33.35,46.3 33.35,41.93 23.9,41.88 23.7,0.23 3.52,0.24 0.21,3.41
  pour Top: 37.46,49.45 39.8,49.45 39.8,46 37.46,46
  pour Bottom (isolate 0.254): 56.92,61.95 18.52,61.95 arc90 14.55,57.99 14.55,44.88 arc-90 11.05,41.37 3.84,41.37 arc90 0.08,37.61 0.08,22.32 arc90 4.65,18.87 5.56,18.82 arc-90 6.93,17.45 6.88,8.46 arc-90 5.26,6.68 0.89,6.68 arc90 0.08,5.76 0.08,3.78 arc90 3.78,0.07 58.5,0.07 arc90 61.95,3.53 61.95,56.92 arc90
  pour Bottom: 0.03,6.47 0.03,8.61 arc-90 3.07,11.66 4.75,11.66 arc90 5.05,11.96 arc-90 5.56,12.47 7.14,12.47 7.14,8.15 arc-90 5.46,6.47
INT0  (via drill 0.25)
  Top 0.406: v25.78,26.44 25.78,28.45 U2.12 | U1.32 35.69,8.04 v35.38,8.35
  Bottom 0.508: v25.78,26.44 29.08,26.44 32.64,22.88 32.64,11.1 v35.38,8.35
ISP_PWR  (via drill 0.25)
  Top 0.61: v17.7,48.43 D2.A
  Bottom 0.406: ISP.2 27.36,18.82
  Bottom 0.508: ISP.2 27.41,18.87 23.95,18.87 22.43,20.44 22.43,26.29 26.85,30.71 26.85,35.79 17.7,45.03 v17.7,48.43
L_AMP_OUT+
  Top 0.508: CDC_CONNECTOR.8
  Top 0.61: R28.2 48.59,50.97 47.98,51.58 38.43,51.58 37.06,52.96 CDC_CONNECTOR.8
L_AMP_OUT-
  Top 0.508: 34.52,59.62 CDC_CONNECTOR.3
  Top 0.61: 34.52,59.62 34.52,53.92 37.94,50.5 45.74,50.5 R27.2
LOUT+  (via drill 0.25)
  Top 0.406: R19.1 45.29,27.51 v47.12,25.68
  Bottom 0.406: v47.12,25.68 58.14,25.68 59.05,26.59 59.05,29.28 59.77,29.99 U4.40
LOUT-  (via drill 0.25)
  Top 0.406: R20.1 47.47,27.1 v47.93,26.64
  Bottom 0.406: v47.93,26.64 56.31,26.64 57.38,27.71 57.38,31.5 U4.38
MIC_BIAS  (via drill 0.25)
  Top 0.305: C7.1 C6.1
  Top 0.406: v48.95,28.17 48.95,23.95 48.64,23.64 48.64,20.39 49.05,19.99 49.84,19.99 C7.1
  Top 0.508: C7.1 49.86,16.23 47.42,13.79 R18.2 | C6.1 51.99,16.53 v52.55,15.97 | v57.23,15.97 57.23,17.7 58.14,18.62 C8.2
  Top 0.61: R17.1 R18.2
  Bottom 0.406: U4.31 48.96,28.18 v48.95,28.17
  Bottom 0.508: v52.55,15.97 v57.23,15.97
MIC_L+  (via drill 0.25)
  Top 0.406: v50.16,28.11 50.16,23.95 49.86,23.49 C7.2
  Bottom 0.406: U4.32 v50.16,28.11
MIC_L-  (via drill 0.25)
  Top 0.406: v52.6,28.06 52.6,24.71 54.03,23.29 C5.1
  Bottom 0.406: U4.34 52.56,28.1 v52.6,28.06
MIC_R+  (via drill 0.25)
  Top 0.406: v51.43,28.11 51.43,24 51.99,23.44 C6.2
  Bottom 0.406: U4.33 51.36,28.18 v51.43,28.11
MIC_R-  (via drill 0.25)
  Top 0.406: v53.82,28.06 53.82,25.42 56.06,23.19 C4.1
  Bottom 0.406: U4.35 53.77,28.12 v53.82,28.06
MISO
  Top 0.406: U2.15 ISP.1 30.86,22.37 30.86,19.68 30.09,18.91 U1.16
MOSI  (via drill 0.25)
  Top 0.406: U2.14 28.22,22.43 ISP.4 v26.95,17.5 | U1.15 30.89,17.48 v30.91,17.5
  Bottom 0.406: v30.91,17.5 v26.95,17.5
N$1  (via drill 0.25)
  Top 0.305: U5.22 10.46,14.12 v10.44,14.14
  Top 0.508: v19.63,27.56 R4.2
  Bottom 0.406: v10.44,14.14 18.01,14.14 19.63,15.77 v19.63,27.56
N$2
  Top 0.305: R23.1 43.1,39.24 43.61,38.73 46.51,38.73 47.27,39.49 49.15,39.49 49.45,39.19 U7.2 | R19.2 45.29,34.82 46.3,35.84 48.84,35.84 49.45,36.45 U7.2 | U7.2
N$4
  Top 0.406: Y1.3 23.82,40.08 24.41,39.49 U2.8
N$5
  Top 0.406: U2.7 25.68,39.54 26.22,40.08 Y1.1
N$6
  Top 0.508: R12.2 37.83,39.61 37.26,39.04 BT1.A
N$7
  Top 0.508: R11.2 38.99,44.47 39.5,43.96 39.5,39.14 39.19,38.83 BT2.A
N$8  (via drill 0.33)
  Top 0.508: v24.87,33.04 30.3,33.04 32.03,31.32 U2.17 | R9.1 11.88,36.72 v11,35.84
  Bottom 0.508: v24.87,33.04 20.65,37.26 12.42,37.26 v11,35.84
N$9
  Top 0.406: U1.24 28.59,7.61 28.27,7.29 23.55,7.29 | 23.09,9.76 R13.1
  Top 0.508: 23.55,7.29 23.09,7.74 23.09,9.76
  Top 0.61: R14.2 R13.1
N$10  (via drill 0.25)
  Top 0.305: U5.23 11.04,13.47 v10.44,13.18
  Top 0.508: v20.45,25.52 R5.2
  Bottom 0.406: v10.44,13.18 18.31,13.18 20.4,15.21 v20.45,25.52
N$11
  Top 0.305: R25.1 49.46,40.14 50.11,39.49 U7.3 50.1,36.23 49.15,35.28 47.83,35.28 47.47,34.92 R20.2
N$12
  Top 0.813: RX.C R4.1
N$13
  Top 0.61: CAN1.C R1.1
N$14
  Top 0.305: R24.1 56.96,40.15 52.7,40.15 52.05,39.5 U7.6 52.04,36.4 53.16,35.28 54.63,35.28 54.89,35.02 R21.2
N$15
  Top 0.813: TX.C R5.1
N$16
  Top 0.61: CAN2.C R2.1
N$17
  Top 0.61: PWR.C R3.1
N$18
  Top 0.406: U2.11 24.41,31.16 21.46,34.11 R1.2
N$19
  Top 0.305: R26.1 59.16,39.19 58.65,38.68 55.55,38.68 54.69,39.54 53.06,39.54 52.7,39.19 U7.7 52.7,36.55 53.42,35.84 56.41,35.84 57.07,35.18 R22.2
N$20
  Top 0.305: C25.1 43.15,35.18 44.32,36.34 48.34,36.34 48.79,36.8 U7.1
N$21
  Top 0.305: U7.5 51.4,35.97 52.25,35.13 52.25,34.68 C23.1
N$22
  Top 0.305: U7.4 50.75,35.97 49.96,35.18 C22.1
N$23  (via drill 0.25)
  Top 0.305: 55.3,11.71 GND.2
  Top 0.508: C4.2 56.06,15.82 v55.24,15.01 | R18.1 47.42,9.62 47.83,9.22 54.53,9.22 55.3,9.98 55.3,11.71
  Bottom 0.61: v55.24,15.01 GND.2
N$24
  Top 0.305: R23.2 43.1,42.9 43.66,43.46 46.66,43.46 47.32,42.8 49.15,42.8 49.45,43.1 U7.15 | U7.15 | 46.66,45.74 49,45.74 49.45,45.29 U7.15
  Top 0.406: R27.1 46.15,46.25 46.66,45.74
N$25
  Top 0.305: 57.73,11.75 GND.3
  Top 0.406: GND.3
  Top 0.508: R17.2 45.09,9.52 46.15,8.46 56.62,8.46 57.73,9.57 57.73,11.75 | C5.2 54.03,14.75 54.79,13.99 57.28,13.99 57.73,13.54 GND.3
N$26
  Top 0.305: R25.2 45.28,42.08 49.4,42.08 50.1,42.79 U7.14 50.11,45.49 49.3,46.3 48.84,46.3
  Top 0.406: R28.1 48.59,46.56 48.84,46.3
N$27
  Top 0.305: U7.8 53.35,36.76 53.72,36.4 58.24,36.4 59.41,35.23 C24.1
N$28  (via drill 0.25)
  Top 0.508: v39.85,32.89 37.82,32.89 37.26,33.45 BT1.C
  Bottom 0.406: U4.29 46.56,32.48 46.15,32.89 v39.85,32.89
N$29  (via drill 0.25)
  Top 0.406: v41.43,34.57 BT2.C
  Bottom 0.406: U4.30 47.77,32.6 45.8,34.57 v41.43,34.57
N$31
  Top 0.406: R2.2 21.87,32.08 23.14,30.86 U2.10
N$32
  Top 0.305: R24.2 56.76,42.08 52.76,42.08 52.05,42.79 U7.11 52.04,45.59
  Top 0.406: R29.1 51.18,46.45 52.04,45.59
N$33
  Top 0.305: R26.2 59.16,43.05 58.7,43.51 55.7,43.51 54.94,42.75 53.06,42.75 52.7,43.1 U7.10 52.7,45.59
  Top 0.406: R30.1 53.57,46.45 52.7,45.59
N$35
  Top 0.61: D4.A 14.68,44.19 13.79,43.3 R8.1 13.8,39.72 | 13.8,39.72 C3.2 | 13.8,39.72 13.8,37.54 R9.2
PWR_IN
  Top 0.61: D3.C 10.95,46.3 10.54,45.84 10.54,43.41 9.27,42.19 7.82,42.19
  Top 0.813: D3.C 11.94,47.85 D2.C 11.87,48.49 D1.C | C2.2 7.77,37.55 7.77,41.62 IC1.3 7.69,42.05 7.82,42.19
PWREN  (via drill 0.25)
  Top 0.406: U1.13 32.49,17.02 34.29,18.82 37.41,18.82 38.28,19.68 v38.28,20.29
  Bottom 0.406: U4.19 38.81,23.11 38.28,22.58 v38.28,20.29
R_AMP_OUT+
  Top 0.61: CDC_CONNECTOR.7 43.79,54.66 44.53,53.92 51.23,53.92 53.57,51.53 R30.2
R_AMP_OUT-
  Top 0.508: 39.55,59.65 CDC_CONNECTOR.2
  Top 0.61: R29.2 51.18,51.08 49.55,52.7 40.92,52.7 39.55,54.07 39.55,59.65
RESET  (via drill 0.25)
  Top 0.406: U1.29 33.29,4.03 33.63,3.76 C10.2 | R10.2 36.83,3.74
  Top 0.508: v36.85,5.25 36.85,3.81 R10.2
  Top 0.813: 36.83,3.74 C10.2
  Bottom 0.5: ISP.5 24.41,26.34 25.93,27.86 29.95,27.86 34.04,23.85 34.04,12.32
  Bottom 0.508: 34.04,12.32 36.85,9.5 v36.85,5.25
RESET_PIN  (via drill 0.25)
  Top 0.305: 26.82,8.94 v26.8,8.96
  Top 0.406: U1.23 26.82,8.94
  Bottom 0.406: U4.4 56.16,17.4 55.7,16.94 51.08,16.94 50.16,16.02 50.16,10.28 54.33,6.12 54.33,1.7 53.77,1.14 41.63,1.14 36.45,1.14 35.38,2.21 35.38,5.92 34.72,6.58 27.76,6.58 26.8,7.54 v26.8,8.96
ROUT+  (via drill 0.25)
  Top 0.406: v58.14,28.88 55.75,28.88 54.89,29.74 R21.1
  Bottom 0.406: U4.39 58.6,31.48 58.6,30.15 58.14,29.69 v58.14,28.88
ROUT-  (via drill 0.25)
  Top 0.406: v56.31,29.79 56.82,29.79 57.07,30.05 R22.1
  Bottom 0.406: U4.37 56.16,29.99 v56.31,29.79
RS  (via drill 0.25)
  Top 0.406: U3.8 24.8,46.24 24.41,46.2 R7.1 | U1.26 30.86,6.68 30.86,7.59 31.17,7.9 v31.62,7.9
  Top 0.508: v31.62,13.48 v35.38,13.48 | v28.32,42.95 26.7,44.57 U3.8
  Bottom 0.508: v35.38,13.48 35.38,24.71 28.32,31.77 v28.32,42.95 | v31.62,7.9 v31.62,13.48
RTS
  Top 0.305: U5.2 20.36,10.87 20.9,10.33 20.9,7.13 21.97,6.07 25.98,6.07 | 34.64,1.75 C10.1
  Top 0.406: 25.98,6.07 27.2,4.85 27.2,2.56
  Top 0.508: 27.2,2.56 28.02,1.75 34.64,1.75
RX
  Top 0.305: U5.5 20.65,12.82 21.51,11.96 21.51,7.64 22.48,6.68 28.68,6.68 30.66,8.66 33.71,8.66 34.87,7.49 34.87,6.67 U1.31
RXCAN
  Top 0.508: U2.2 32.03,41.12 28.78,44.37 28.78,49.25 29.59,50.06 31.88,50.06 U3.4
SCK
  Top 0.406: U1.17 27.81,13.74 27.15,14.4 27.15,15.67 25.68,17.15 25.68,22.43 ISP.3 U2.13
STATUS_PIN  (via drill 0.25)
  Top 0.406: U1.1 41.38,8.14 43.41,6.12 v55.55,6.12
  Bottom 0.406: U4.2 58.56,15.3 59.71,14.14 59.71,9.32 56.52,6.12 v55.55,6.12
TX  (via drill 0.25)
  Top 0.305: v25.27,5.36 21.72,5.36 18.11,8.96 18.11,9.83 18.51,10.22 U5.1 | 34.06,6.62 U1.30
  Top 0.406: v34.06,5.36 34.06,6.62
  Bottom 0.508: v25.27,5.36 v34.06,5.36
TXCAN
  Top 0.508: U2.1 33.3,43.86 31.88,45.29 31.88,46.22 U3.1
UART_CTS  (via drill 0.25)
  Top 0.406: U1.11 34.16,15.31 34.16,16.28 35.05,17.17 38.86,17.17 39.62,16.41 43.25,16.41 v44.16,15.49
  Bottom 0.508: UART.3 49.94,5.46 44.16,11.28 v44.16,15.49 U4.14
UART_RTS  (via drill 0.25)
  Top 0.406: U1.12 33.29,16.42 34.8,17.93 39.12,17.93 40,17.04 44.7,17.04 v45.39,16.35
  Bottom 0.508: UART.4 52.48,4.7 45.39,11.78 v45.39,16.35 45.36,16.38 U4.13
UART_RX  (via drill 0.25)
  Top 0.406: U1.9 38.3,15.24 v38.58,15.26
  Bottom 0.508: UART.1 44.86,7.34 41.77,10.43 41.77,15.26 | U4.16 41.77,15.26 | v38.58,15.26 41.77,15.26
UART_TX  (via drill 0.25)
  Top 0.406: U1.10 34.92,15.27 34.92,16.02 35.31,16.41 38.61,16.41 39.24,15.77 42.23,15.77 v42.96,15.03
  Bottom 0.508: UART.2 47.4,6.37 42.96,10.8 v42.96,15.03 U4.15
USB_PWR  (via drill 0.25)
  Top 0.305: v15.26,12.16 15.26,14.96 14.81,15.41 12.13,15.41 U5.20 12.11,15.41 v10.39,15.41 | U5.4 v17.5,12.16
  Top 0.406: v15.26,12.16 15.26,8.4 18.72,4.95 | v14.4,28.88 11.15,28.88 10.74,28.47 10.74,27.59 RX.A 10.9,27.57
  Top 0.508: 18.72,4.95 C12.2 | 16.48,35.84 14.66,35.84 v14.4,35.58
  Top 0.61: D3.A 17.14,46.3 17.7,45.74 17.7,37.11 16.48,35.84 | 11.1,27.56 RX.A TX.A v10.71,23.9 | C14.2 C13.1 C12.2
  Bottom 0.406: v17.5,12.16 v15.26,12.16 | UPLOAD.VBUS 3.05,14.2 2.41,14.2 1.8,14.81 1.8,18.67 2.82,19.68 10.29,19.68 10.39,19.68 v10.39,15.41
  Bottom 0.508: v14.4,35.58 v14.4,28.88 | v10.71,23.9 10.71,20.11 10.29,19.68
USBDM
  Top 0.305: U5.16 8.58,18.02 7.49,16.94 7.49,13.43
  Top 0.508: C16.2 11.96,7.08 7.49,11.5 7.49,13.43 UPLOAD.D-
USBDP
  Top 0.305: U5.15 2.42,18.67 1.29,17.55 1.29,12.62
  Top 0.508: UPLOAD.D+ 1.29,12.62 1.29,8.51 3.43,6.37 8.51,6.37 9.68,5.2 C17.2
XTAL1
  Top 0.406: U1.7 38.51,12.94 39.3,12.16 Y2.1
XTAL2
  Top 0.406: U1.8 38.49,13.74 39.3,14.56 Y2.3

### Text on the board
bPlace: TX | RX | CTS | RTS | UART
tNames: L- | R- | 12V | CANL | L+ | R+ | NCP1117 | CANH | D5 | 0.1uF | U6 | GND | C28 | R27 | R28 | R29 | R30 | D1 | R16 | C18 | C26 | C27 | D2 | 100Ω | D3 | C19 | C29 | R7 | U3 | D4 | R11 | 10uF | 10K | Y1 | U2 | R12 | U7 | R8 | C2 | C1 | C3 | R23 | R25 | R24 | 2K | R26 | R9 | 10K | ^ | CAN1 | R1 | CAN2 | R2 | R20 | C22 | C23 | R21 | R22 | C24 | 0.22uF | PWR | R3 | C25 | R19 | 1K | 3V3 | RX | R4 | TX | R5 | RST | SCK | MISO | v5.5 | ISP | C21 | C20 | GND | MOSI | 3V3 | C7 | C6 | C5 | C4 | C8 | C15 | R33 | MIC | U5 | Y2 | GND | UPLOAD | R14 | U1 | R13 | GND | R17 | R18 | 47pF | CTS | RTS | TX | RX | C17 | C16 | C14 | C13 | C12 | C11 | C10 | R10 | C9 | UART
bNames: 12V | CANL | L- | R- | L+ | R+ | GND | CANH | U4 | BT1 | BT2 | MIC BIAS | ML+ | MR+ | ML- | MR- | AGND | R- | L- | R+ | L+ | GND | GND | 3V3 | RST | SCK | MISO | 3V3 | PWREN | ISP | GPIO7 | GND | MOSI | 3V3 | GND | URX | UTX | UCTS | URTS | GPIO9 | GPIO4 | AIC0 | GPIO2 | GPIO3 | GND | PWR | D- | D+ | GND | GND | GND | 1K
BlueSAAB: v5.5
DrillLegend: LAYER-STACK
DrillLegend_01-16: 01-16
DrillLegend_01-20: 01-20